# Altium schematic sheet POWER.SchDoc: F2837x controlCARD
size 431 x 279 mm; Organization: Texas Instruments; Revision: 1.3
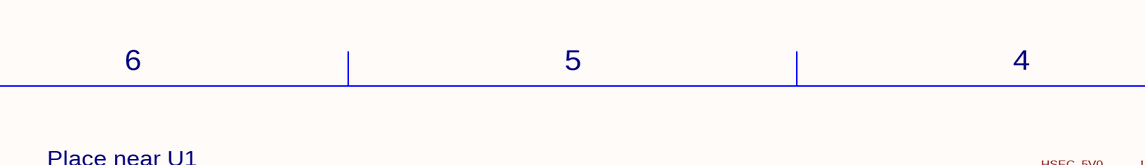
[diagram p0: POWER.SchDoc, top left]
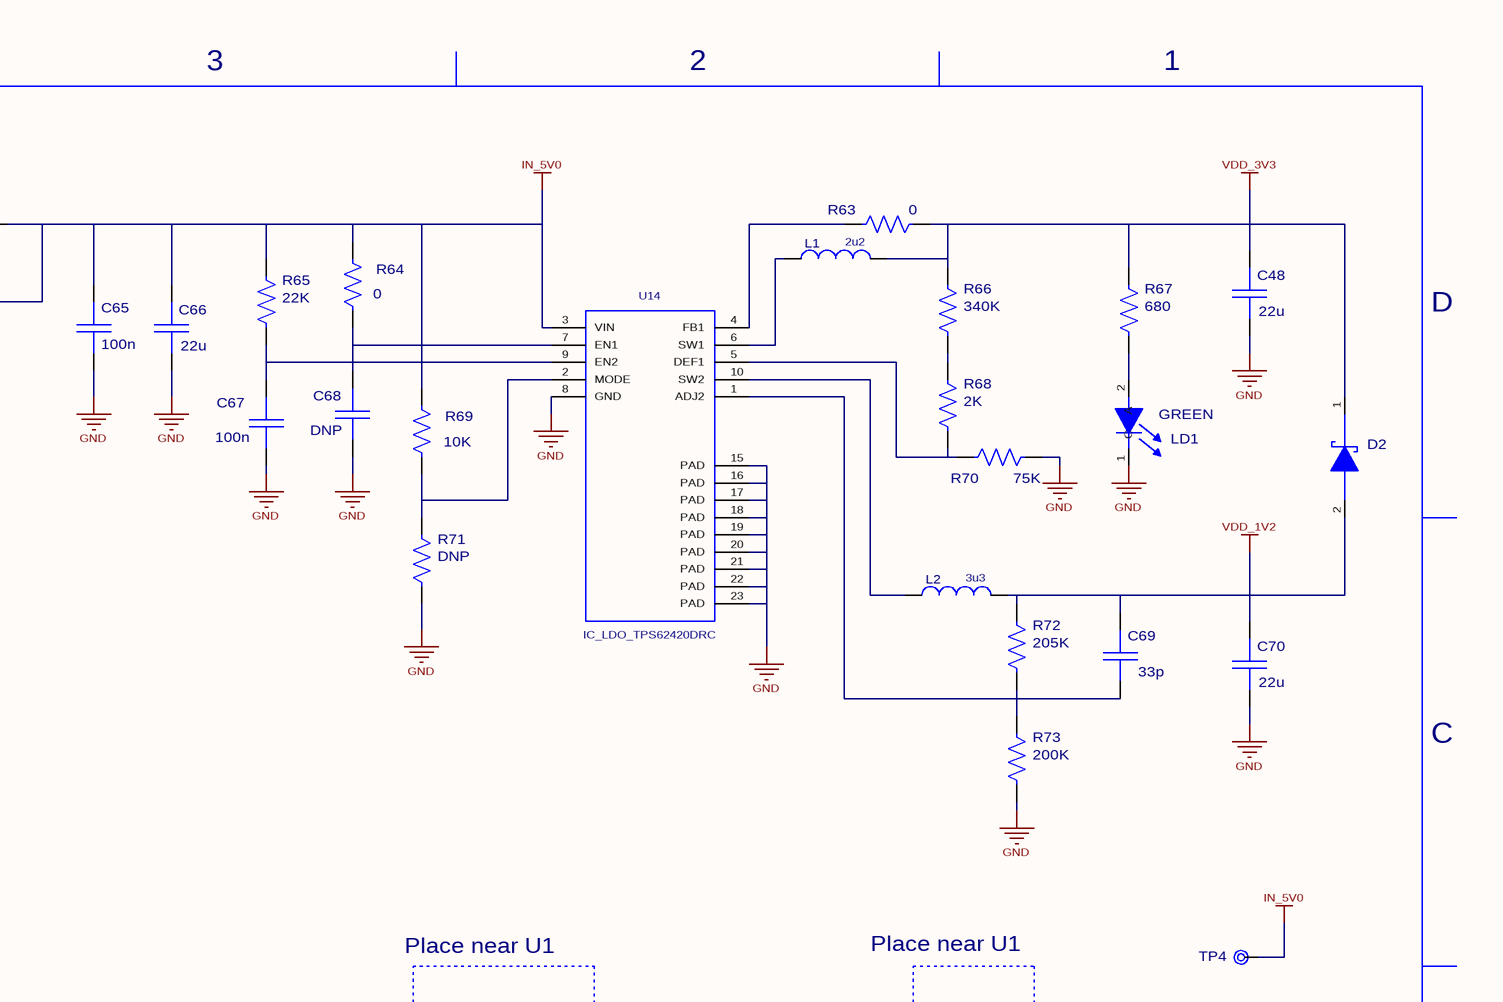
[diagram p1: POWER.SchDoc, top right]
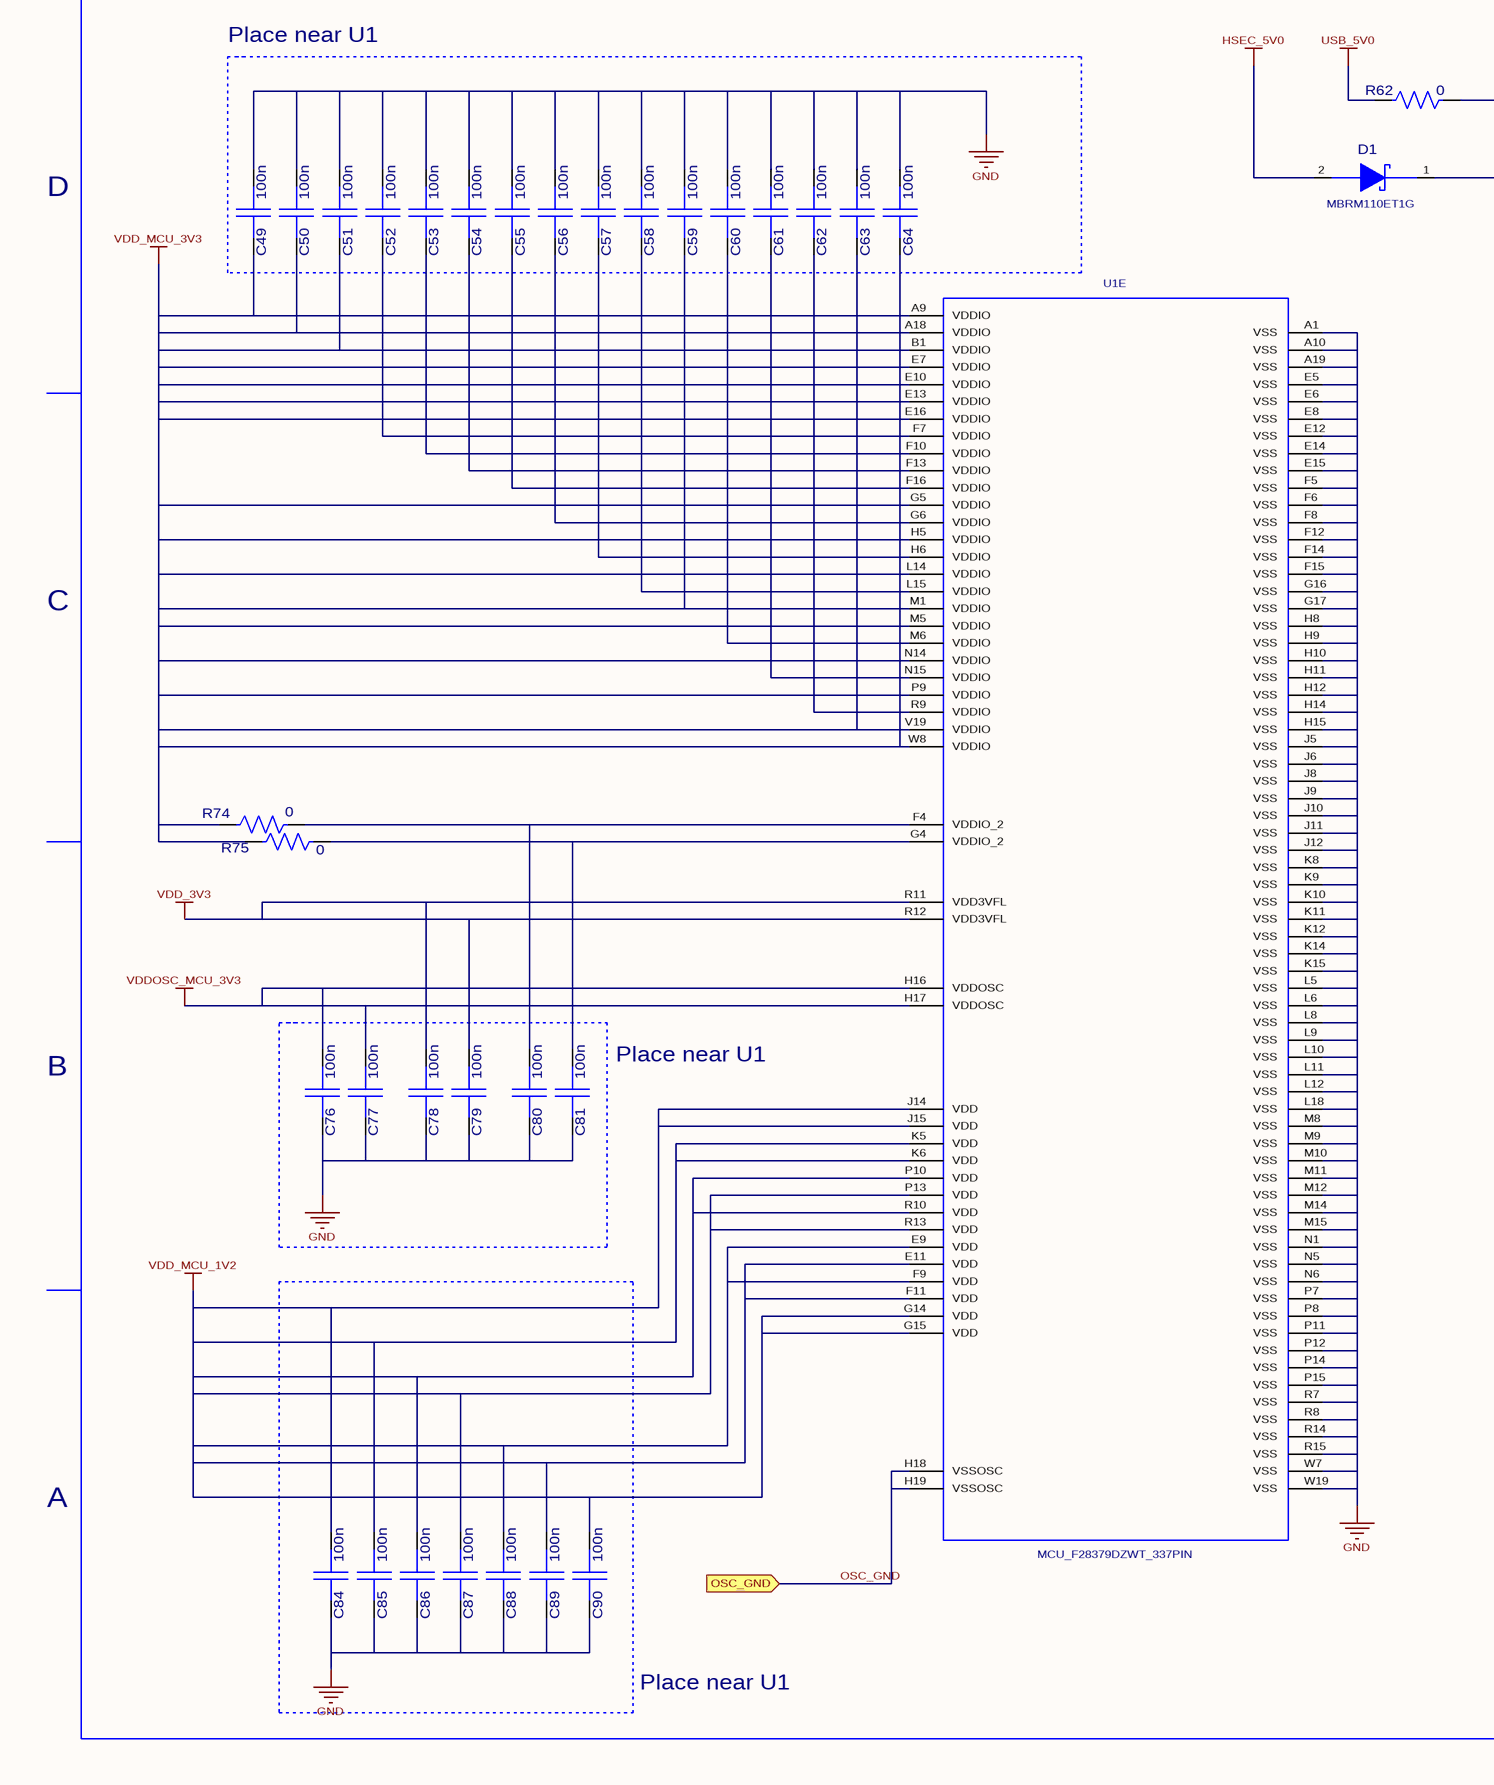
[diagram p2: POWER.SchDoc, bottom left]
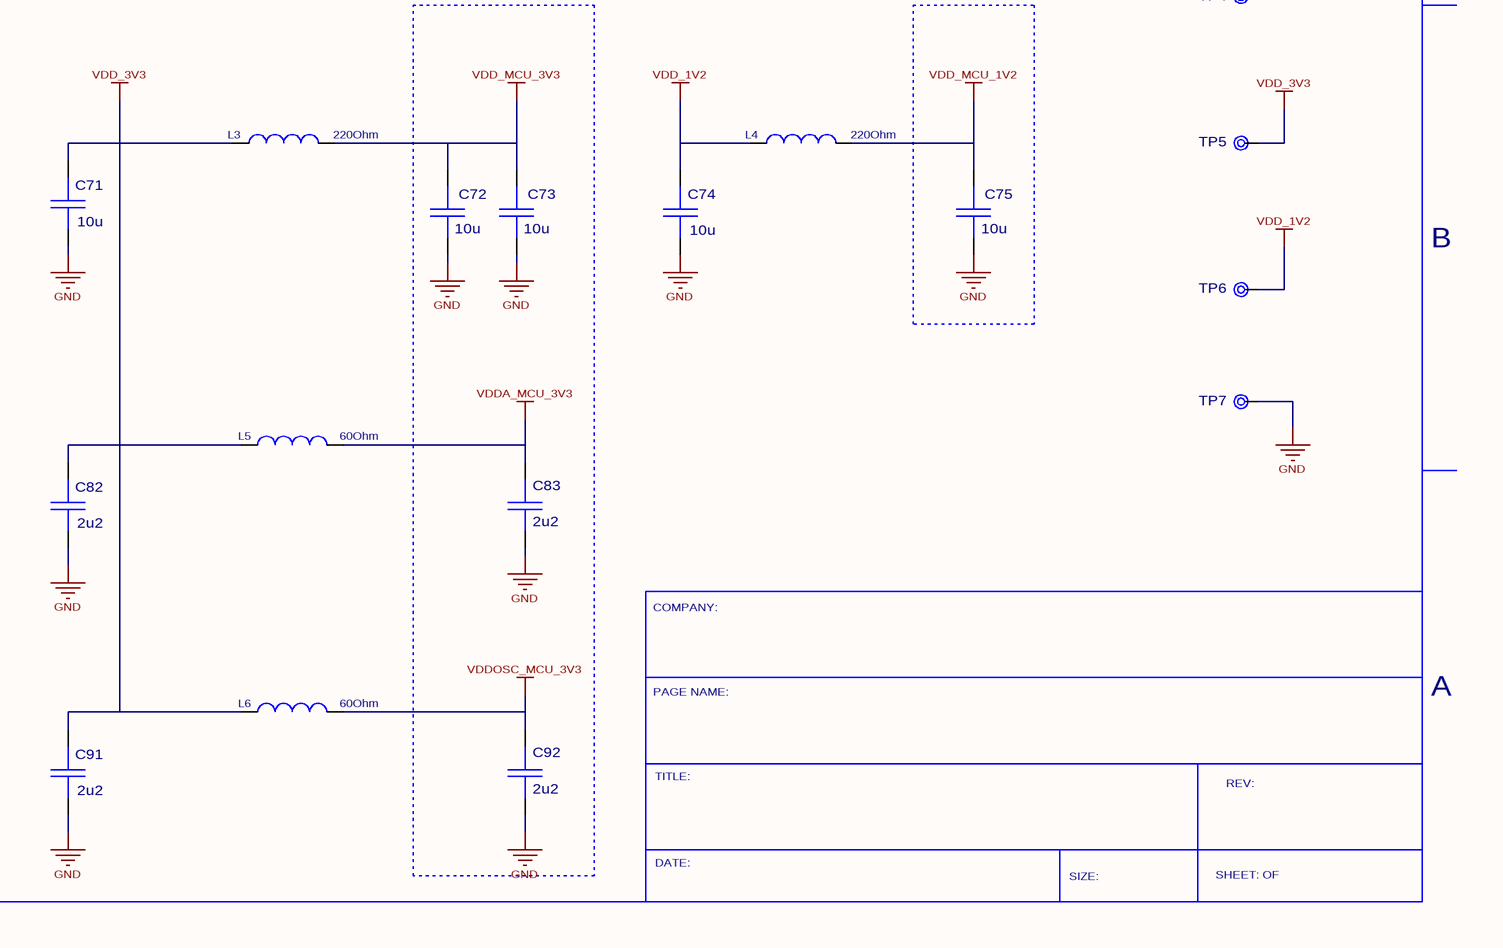
[diagram p3: POWER.SchDoc, bottom right]

## Parts
C48  value 22u  [C0805]  (hidden comment: C0805_16V_X7R)
C49  value 100n  [C0402]  (hidden comment: C0402_16V_X7R)
C50  value 100n  [C0402]  (hidden comment: C0402_16V_X7R)
C51  value 100n  [C0402]  (hidden comment: C0402_16V_X7R)
C52  value 100n  [C0402]  (hidden comment: C0402_16V_X7R)
C53  value 100n  [C0402]  (hidden comment: C0402_16V_X7R)
C54  value 100n  [C0402]  (hidden comment: C0402_16V_X7R)
C55  value 100n  [C0402]  (hidden comment: C0402_16V_X7R)
C56  value 100n  [C0402]  (hidden comment: C0402_16V_X7R)
C57  value 100n  [C0402]  (hidden comment: C0402_16V_X7R)
C58  value 100n  [C0402]  (hidden comment: C0402_16V_X7R)
C59  value 100n  [C0402]  (hidden comment: C0402_16V_X7R)
C60  value 100n  [C0402]  (hidden comment: C0402_16V_X7R)
C61  value 100n  [C0402]  (hidden comment: C0402_16V_X7R)
C62  value 100n  [C0402]  (hidden comment: C0402_16V_X7R)
C63  value 100n  [C0402]  (hidden comment: C0402_16V_X7R)
C64  value 100n  [C0402]  (hidden comment: C0402_16V_X7R)
C65  value 100n  [C0402]  (hidden comment: C0402_16V_X7R)
C66  value 22u  [C0805]  (hidden comment: C0805_16V_X7R)
C67  value 100n  [C0402]  (hidden comment: C0402_16V_X7R)
C68  value DNP  [C0402]  (hidden comment: C0402_16V_X7R)
C69  value 33p  [C0402]  (hidden comment: C0402_50V_NP0)
C70  value 22u  [C0805]  (hidden comment: C0805_16V_X7R)
C71  value 10u  [C0805]  (hidden comment: C0805_16V_X7R)
C72  value 10u  [C0603]  (hidden comment: C0603_16V_X7R)
C73  value 10u  [C0603]  (hidden comment: C0603_16V_X7R)
C74  value 10u  [C0805]  (hidden comment: C0805_16V_X7R)
C75  value 10u  [C0603]  (hidden comment: C0603_16V_X7R)
C76  value 100n  [C0402]  (hidden comment: C0402_16V_X7R)
C77  value 100n  [C0402]  (hidden comment: C0402_16V_X7R)
C78  value 100n  [C0402]  (hidden comment: C0402_16V_X7R)
C79  value 100n  [C0402]  (hidden comment: C0402_16V_X7R)
C80  value 100n  [C0402]  (hidden comment: C0402_16V_X7R)
C81  value 100n  [C0402]  (hidden comment: C0402_16V_X7R)
C82  value 2u2  [C0805]  (hidden comment: C0805_16V_X7R)
C83  value 2u2  [C0603]  (hidden comment: C0603_16V_X7R)
C84  value 100n  [C0402]  (hidden comment: C0402_16V_X7R)
C85  value 100n  [C0402]  (hidden comment: C0402_16V_X7R)
C86  value 100n  [C0402]  (hidden comment: C0402_16V_X7R)
C87  value 100n  [C0402]  (hidden comment: C0402_16V_X7R)
C88  value 100n  [C0402]  (hidden comment: C0402_16V_X7R)
C89  value 100n  [C0402]  (hidden comment: C0402_16V_X7R)
C90  value 100n  [C0402]  (hidden comment: C0402_16V_X7R)
C91  value 2u2  [C0805]  (hidden comment: C0805_16V_X7R)
C92  value 2u2  [C0603]  (hidden comment: C0603_16V_X7R)
D1  Part Number: MBRM110ET1G  [DO-216AA]  (hidden comment: DIODE_SCHOTTKY_MBRM110ET1G)
D2  DIODE_SCHOTTKY_CFSH05-20L  [SOD882L]  (value not drawn)
L1  value 2u2  [IND_SMD_VLF3010A_COILS]  (hidden comment: IND_VLF3010AT-2R2M1R0)
L2  value 3u3  [IND_SMD_VLF3010A_COILS]  (hidden comment: IND_VLF3010AT-3R3MR87)
L3  value 220Ohm  [L0805]  (hidden comment: L0805_BLM21PG221SN1D)
L4  value 220Ohm  [L0805]  (hidden comment: L0805_BLM21PG221SN1D)
L5  value 60Ohm  [L0805]  (hidden comment: L0805_BKP2125HS600-T)
L6  value 60Ohm  [L0805]  (hidden comment: L0805_BKP2125HS600-T)
LD1  value GREEN  [LED0805]  (hidden comment: LED0805_GREEN)
R62  value 0  [R0805]  (hidden comment: R0805_5%)
R63  value 0  [R0402]  (hidden comment: R0402_5%)
R64  value 0  [R0402]  (hidden comment: R0402_5%)
R65  value 22K  [R0402]  (hidden comment: R0402_1%)
R66  value 340K  [R0402]  (hidden comment: R0402_1%)
R67  value 680  [R0402]  (hidden comment: R0402_5%)
R68  value 2K  [R0402]  (hidden comment: R0402_1%)
R69  value 10K  [R0402]  (hidden comment: R0402_5%)
R70  value 75K  [R0402]  (hidden comment: R0402_1%)
R71  value DNP  [R0603]  (hidden comment: R0603_5%)
R72  value 205K  [R0402]  (hidden comment: R0402_1%)
R73  value 200K  [R0402]  (hidden comment: R0402_1%)
R74  value 0  [R0603]  (hidden comment: R0603_5%)
R75  value 0  [R0603]  (hidden comment: R0603_5%)
TP4  VIA_20_40  [VIA_20_40]  (value not drawn)
TP5  VIA_20_40  [VIA_20_40]  (value not drawn)
TP6  VIA_20_40  [VIA_20_40]  (value not drawn)
TP7  VIA_20_40  [VIA_20_40]  (value not drawn)
U1  MCU_F28379DZWT_337PIN  [TI_ZWT_337BGA]  (part E of 5)
U14  IC_LDO_TPS62420DRC  [TI_DRC_10]

## Ports
OSC_GND

## Nets
GND: C48.1 C49.2 C50.2 C51.2 C52.2 C53.2 C54.2 C55.2 C56.2 C57.2 C58.2 C59.2 C60.2 C61.2 C62.2 C63.2 C64.2 C65.1 C66.1 C67.1 C68.1 C70.1 C71.1 C72.1 C73.1 C74.1 C75.1 C76.1 C77.1 C78.1 C79.1 C80.1 C81.1 C82.1 C83.1 C84.1 C85.1 C86.1 C87.1 C88.1 C89.1 C90.1 C91.1 C92.1 LD1.1(C) R70.2 R71.2 R73.2 TP7.1 U1.A1(VSS) U1.A10(VSS) U1.A19(VSS) U1.E5(VSS) U1.E6(VSS) U1.E8(VSS) U1.E12(VSS) U1.E14(VSS) U1.E15(VSS) U1.F5(VSS) U1.F6(VSS) U1.F8(VSS) U1.F12(VSS) U1.F14(VSS) U1.F15(VSS) U1.G16(VSS) U1.G17(VSS) U1.H8(VSS) U1.H9(VSS) U1.H10(VSS) U1.H11(VSS) U1.H12(VSS) U1.H14(VSS) U1.H15(VSS) U1.J5(VSS) U1.J6(VSS) U1.J8(VSS) U1.J9(VSS) U1.J10(VSS) U1.J11(VSS) U1.J12(VSS) U1.K8(VSS) U1.K9(VSS) U1.K10(VSS) U1.K11(VSS) U1.K12(VSS) U1.K14(VSS) U1.K15(VSS) U1.L5(VSS) U1.L6(VSS) U1.L8(VSS) U1.L9(VSS) U1.L10(VSS) U1.L11(VSS) U1.L12(VSS) U1.L18(VSS) U1.M8(VSS) U1.M9(VSS) U1.M10(VSS) U1.M11(VSS) U1.M12(VSS) U1.M14(VSS) U1.M15(VSS) U1.N1(VSS) U1.N5(VSS) U1.N6(VSS) U1.P7(VSS) U1.P8(VSS) U1.P11(VSS) U1.P12(VSS) U1.P14(VSS) U1.P15(VSS) U1.R7(VSS) U1.R8(VSS) U1.R14(VSS) U1.R15(VSS) U1.W7(VSS) U1.W19(VSS) U14.8(GND) U14.15(PAD) U14.16(PAD) U14.17(PAD) U14.18(PAD) U14.19(PAD) U14.20(PAD) U14.21(PAD) U14.22(PAD) U14.23(PAD)
HSEC_5V0: D1.2(A)
IN_5V0: C65.2 C66.2 D1.1(C) R62.2 R64.2 R65.1 R69.2 TP4.1 U14.3(VIN)
USB_5V0: R62.1
VDD_1V2: C69.2 C70.2 C74.2 D2.2(A) L2.2 L4.1 R72.1 TP6.1
VDD_3V3: C48.2 C71.2 C78.2 C79.2 C82.2 C91.2 D2.1(C) L1.2 L3.1 L5.1 L6.1 R63.1 R66.1 R67.1 TP5.1 U1.R11(VDD3VFL) U1.R12(VDD3VFL)
VDD_MCU_1V2: C75.2 C84.2 C85.2 C86.2 C87.2 C88.2 C89.2 C90.2 L4.2 U1.E9(VDD) U1.E11(VDD) U1.F9(VDD) U1.F11(VDD) U1.G14(VDD) U1.G15(VDD) U1.J14(VDD) U1.J15(VDD) U1.K5(VDD) U1.K6(VDD) U1.P10(VDD) U1.P13(VDD) U1.R10(VDD) U1.R13(VDD)
VDD_MCU_3V3: C49.1 C50.1 C51.1 C52.1 C53.1 C54.1 C55.1 C56.1 C57.1 C58.1 C59.1 C60.1 C61.1 C62.1 C63.1 C64.1 C72.2 C73.2 L3.2 R74.1 R75.1 U1.A9(VDDIO) U1.A18(VDDIO) U1.B1(VDDIO) U1.E7(VDDIO) U1.E10(VDDIO) U1.E13(VDDIO) U1.E16(VDDIO) U1.F7(VDDIO) U1.F10(VDDIO) U1.F13(VDDIO) U1.F16(VDDIO) U1.G5(VDDIO) U1.G6(VDDIO) U1.H5(VDDIO) U1.H6(VDDIO) U1.L14(VDDIO) U1.L15(VDDIO) U1.M1(VDDIO) U1.M5(VDDIO) U1.M6(VDDIO) U1.N14(VDDIO) U1.N15(VDDIO) U1.P9(VDDIO) U1.R9(VDDIO) U1.V19(VDDIO) U1.W8(VDDIO)
VDDA_MCU_3V3: C83.2 L5.2
VDDOSC_MCU_3V3: C76.2 C77.2 C92.2 L6.2 U1.H16(VDDOSC) U1.H17(VDDOSC)
OSC_GND: U1.H18(VSSOSC) U1.H19(VSSOSC) ; port OSC_GND
NetC67_2: C67.2 R65.2 U14.9(EN2)
NetC68_2: C68.2 R64.1 U14.7(EN1)
NetC69_1: C69.1 R72.2 R73.1 U14.1(ADJ2)
NetC80_2: C80.2 R74.2 U1.F4(VDDIO_2)
NetC81_2: C81.2 R75.2 U1.G4(VDDIO_2)
NetL1_1: L1.1 U14.6(SW1)
NetL2_1: L2.1 U14.10(SW2)
NetLD1_2: LD1.2(A) R67.2
NetR63_2: R63.2 U14.4(FB1)
NetR66_2: R66.2 R68.1
NetR68_2: R68.2 R70.1 U14.5(DEF1)
NetR69_1: R69.1 R71.1 U14.2(MODE)

## Notes on the sheet
- 6
- 5
- 4
- 3
- 2
- 1
- Place near U1
- D
- C
- B
- (near C81) Place near U1
- COMPANY:
- A
- PAGE NAME:
- TITLE:
- REV:
- DATE:
- SIZE:
- SHEET: OF

## Library data of the parts
C48 C66 C70 = C0805_16V_X7R: CAP CER 6.3V 20% X5R 0805; Decal: C0805; PCB DECAL: C0805
C49-C65 C67 C68 C76-C81 C84-C90 = C0402_16V_X7R: CAP CER 16V 10% X7R 0402; Decal: C0402; PCB DECAL: C0402
C69 = C0402_50V_NP0: CAP CER 50V NP0 0402; Decal: C0402; PCB DECAL: C0402
C71 C74 C82 C91 = C0805_16V_X7R: CAP CER 10V 20% X5R 0805; Decal: C0805; PCB DECAL: C0805
C72 C73 C75 = C0603_16V_X7R: CAP CER 6.3V 20% X5R 0603; Decal: C0603; PCB DECAL: C0603
C83 C92 = C0603_16V_X7R: CAP CER 10V 20% X5R 0603; Decal: C0603; PCB DECAL: C0603
D1 = DIODE_SCHOTTKY_MBRM110ET1G: DIODE SCHOTTKY 10V 1A POWERMITE; Manufacturer: On Semiconductor; Decal: DO-216AA; Digikey: MBRM110ET1GOSCT-ND; PCB DECAL: DO-216AA
D2 = DIODE_SCHOTTKY_CFSH05-20L: DIODE SCHOTTKY, 220mV@10mA, SOD882L; Manufacturer: Central Semiconductor Corp; Part Number: CFSH05-20L TR; Decal: SOD882L; Digikey: CFSH05-20L CT-ND; PCB DECAL: SOD882L
L1 = IND_VLF3010AT-2R2M1R0: Inductor Power 2.2uH 1.0A SMD 20%; Manufacturer: TDK Corporation; Decal: IND_SMD_VLF3010A_COILS; Digikey: 445-3215-1-ND; Height: 1 (mm); Part Number: VLF3010AT-2R2M1R0; Size: 2.8 L x 2.6 W (mm); PCB DECAL: IND_SMD_VLF3010A_COILS
L2 = IND_VLF3010AT-3R3MR87: Inductor Power 3.3uH 0.87A SMD 20%; Manufacturer: TDK Corporation; Decal: IND_SMD_VLF3010A_COILS; Digikey: 445-3216-1-ND; Height: 1 (mm); Part Number: VLF3010AT-3R3MR87; Size: 2.8 L x 2.6 W (mm); PCB DECAL: IND_SMD_VLF3010A_COILS
L3 L4 = L0805_BLM21PG221SN1D: FERRITE 2A 220OHM@100MHz 0805 SMD; Decal: L0805; Digikey: 490-1054-1-ND; Part Number: BLM21PG221SN1D; PCB DECAL: L0805
L5 L6 = L0805_BKP2125HS600-T: FERRITE 3A 60OHM@100MHz 0805 SMD; Decal: L0805; Digikey: 587-1932-1-ND; Part Number: BKP2125HS600-T; PCB DECAL: L0805
LD1 = LED0805_GREEN: LED GREEN 0805 SMD, Diffused, 567nm; Decal: LED0805; PCB DECAL: LED0805
R62 = R0805_5%: RES 1/8W 5% 0805 SMD; Decal: R0805; PCB DECAL: R0805
R63 R64 R67 R69 = R0402_5%: RES 1/16W 5% 0402 SMD; Decal: R0402; PCB DECAL: R0402
R65 R66 R68 R72 = R0402_1%: RES 1/16W 1% 0402 SMD; Decal: R0402; PCB DECAL: R0402
R70 R73 = R0402_1%: RES 1/16W 0.5% 0402 SMD; Decal: R0402; PCB DECAL: R0402
R71 R74 R75 = R0603_5%: RES 1/10W 5% 0603 SMD; Decal: R0603; PCB DECAL: R0603
TP4-TP7 = VIA_20_40: Via, 20 ID, 40 OD (mil); Decal: VIA_20_40; Size: 20 ID, 40 OD (mil); PCB DECAL: VIA_20_40
U1 = MCU_F28379DZWT_337PIN: MCU F2837x 337pin ZWT BGA; Part Number: TMS320F28379DZWT; Decal: TI_ZWT_337BGA; PCB DECAL: TI_ZWT_337BGA
U14 = IC_LDO_TPS62420DRC: IC Dual Step Down Converter, 2.25MHz, 600mA/1A; Decal: TI_DRC10; Digikey: 296-25650-1-ND; Part Number: TPS62420DRC; PCB DECAL: TI_DRC_10